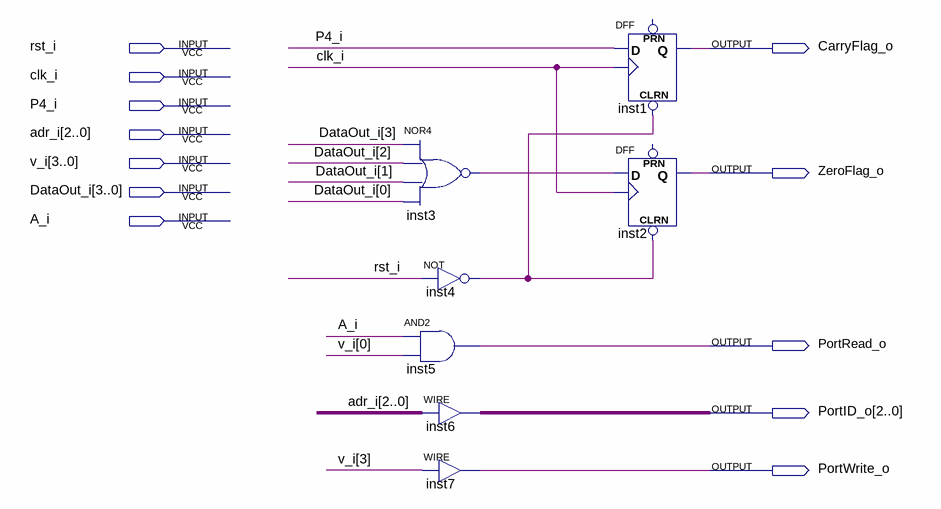
[diagram p0: schematic sheet]
// Quartus schematic FAP.bdf as structural Verilog: 7 symbols, 12 pins
module FAP (
  input  rst_i,
  input  clk_i,
  input  P4_i,
  input  [2:0] adr_i,
  input  [3:0] v_i,
  input  [3:0] DataOut_i,
  input  A_i,
  output CarryFlag_o,
  output ZeroFlag_o,
  output PortRead_o,
  output [2:0] PortID_o,
  output PortWrite_o
);

  wire inst3_out, inst4_out;

  nor inst3 (inst3_out, DataOut_i[3], DataOut_i[2], DataOut_i[1], DataOut_i[0]);
  not inst4 (inst4_out, rst_i);
  and inst5 (PortRead_o, A_i, v_i[0]);
  assign PortID_o = adr_i;  // WIRE inst6
  assign PortWrite_o = v_i[3];  // WIRE inst7
  DFF inst1 (.CLRN(inst4_out), .CLK(clk_i), .D(P4_i), .Q(CarryFlag_o));  // open: PRN
  DFF inst2 (.CLRN(inst4_out), .CLK(clk_i), .D(inst3_out), .Q(ZeroFlag_o));  // open: PRN
endmodule
